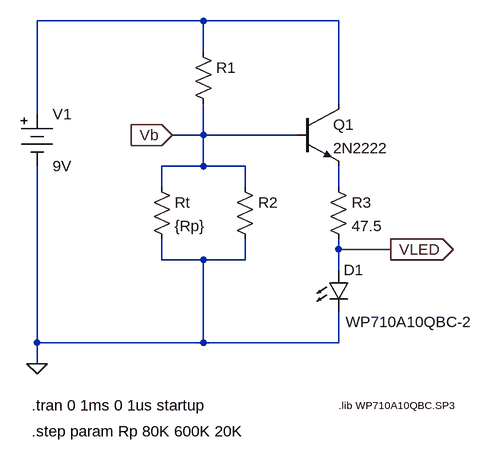
[diagram p0: schematic Thermo-sensor Completed Circuit.asc]
Thermo-sensor Completed Circuit.asc, the LTspice schematic file:
Version 4
SHEET 1 936 680
WIRE 112 -48 -144 -48
WIRE 320 -48 112 -48
WIRE 112 0 112 -48
WIRE 320 80 320 -48
WIRE -144 96 -144 -48
WIRE 112 128 112 80
WIRE 112 128 64 128
WIRE 256 128 112 128
WIRE 112 176 112 128
WIRE 112 176 48 176
WIRE 176 176 112 176
WIRE 48 208 48 176
WIRE 176 208 176 176
WIRE 320 208 320 176
WIRE 320 304 320 288
WIRE 400 304 320 304
WIRE 48 320 48 288
WIRE 112 320 48 320
WIRE 176 320 176 288
WIRE 176 320 112 320
WIRE 320 336 320 304
WIRE -144 448 -144 176
WIRE 112 448 112 320
WIRE 112 448 -144 448
WIRE 320 448 320 400
WIRE 320 448 112 448
WIRE -144 480 -144 448
FLAG -144 480 0
FLAG 400 304 VLED
IOPIN 400 304 Out
FLAG 64 128 Vb
IOPIN 64 128 In
SYMBOL res 96 -16 R0
WINDOW 3 36 76 Invisible 2
SYMATTR Value 200K
SYMATTR InstName R1
SYMATTR SpiceLine tol=1 pwr=0.1
SYMBOL res 32 192 R0
SYMATTR InstName Rt
SYMATTR Value {Rp}
SYMATTR SpiceLine tol=1 pwr=0.1
SYMBOL res 304 192 R0
SYMATTR InstName R3
SYMATTR Value 47.5
SYMATTR SpiceLine tol=1 pwr=0.1
SYMBOL npn 256 80 R0
SYMATTR InstName Q1
SYMATTR Value 2N2222
SYMBOL LED 304 336 R0
WINDOW 3 27 80 Left 2
SYMATTR Value WP710A10QBC-2
SYMATTR InstName D1
SYMBOL battery -144 80 R0
WINDOW 123 0 0 Left 2
SYMATTR SpiceLine Rser=10
SYMATTR InstName V1
SYMATTR Value 9V
SYMBOL res 160 192 R0
WINDOW 3 36 76 Invisible 2
SYMATTR Value 200K
SYMATTR InstName R2
SYMATTR SpiceLine tol=1 pwr=0.1
TEXT -152 544 Left 2 !.tran 0 1ms 0 1us startup
TEXT -152 584 Left 2 !.step param Rp 80K 600K 20K
TEXT 320 544 Left 1 !.lib WP710A10QBC.SP3

The netlist it stands for:
* Thermo-sensor Completed Circuit.asc
R1 N001 Vb 200K tol=1 pwr=0.1
Rt Vb 0 {Rp} tol=1 pwr=0.1
R3 N002 VLED 47.5 tol=1 pwr=0.1
Q1 N001 Vb N002 0 2N2222
D1 VLED 0 WP710A10QBC-2
V1 N001 0 9V Rser=10
R2 Vb 0 200K tol=1 pwr=0.1
.model D D
.lib standard.dio
.model NPN NPN
.model PNP PNP
.lib standard.bjt
.tran 0 1ms 0 1us startup
.step param Rp 80K 600K 20K
.lib WP710A10QBC.SP3
.backanno
.end